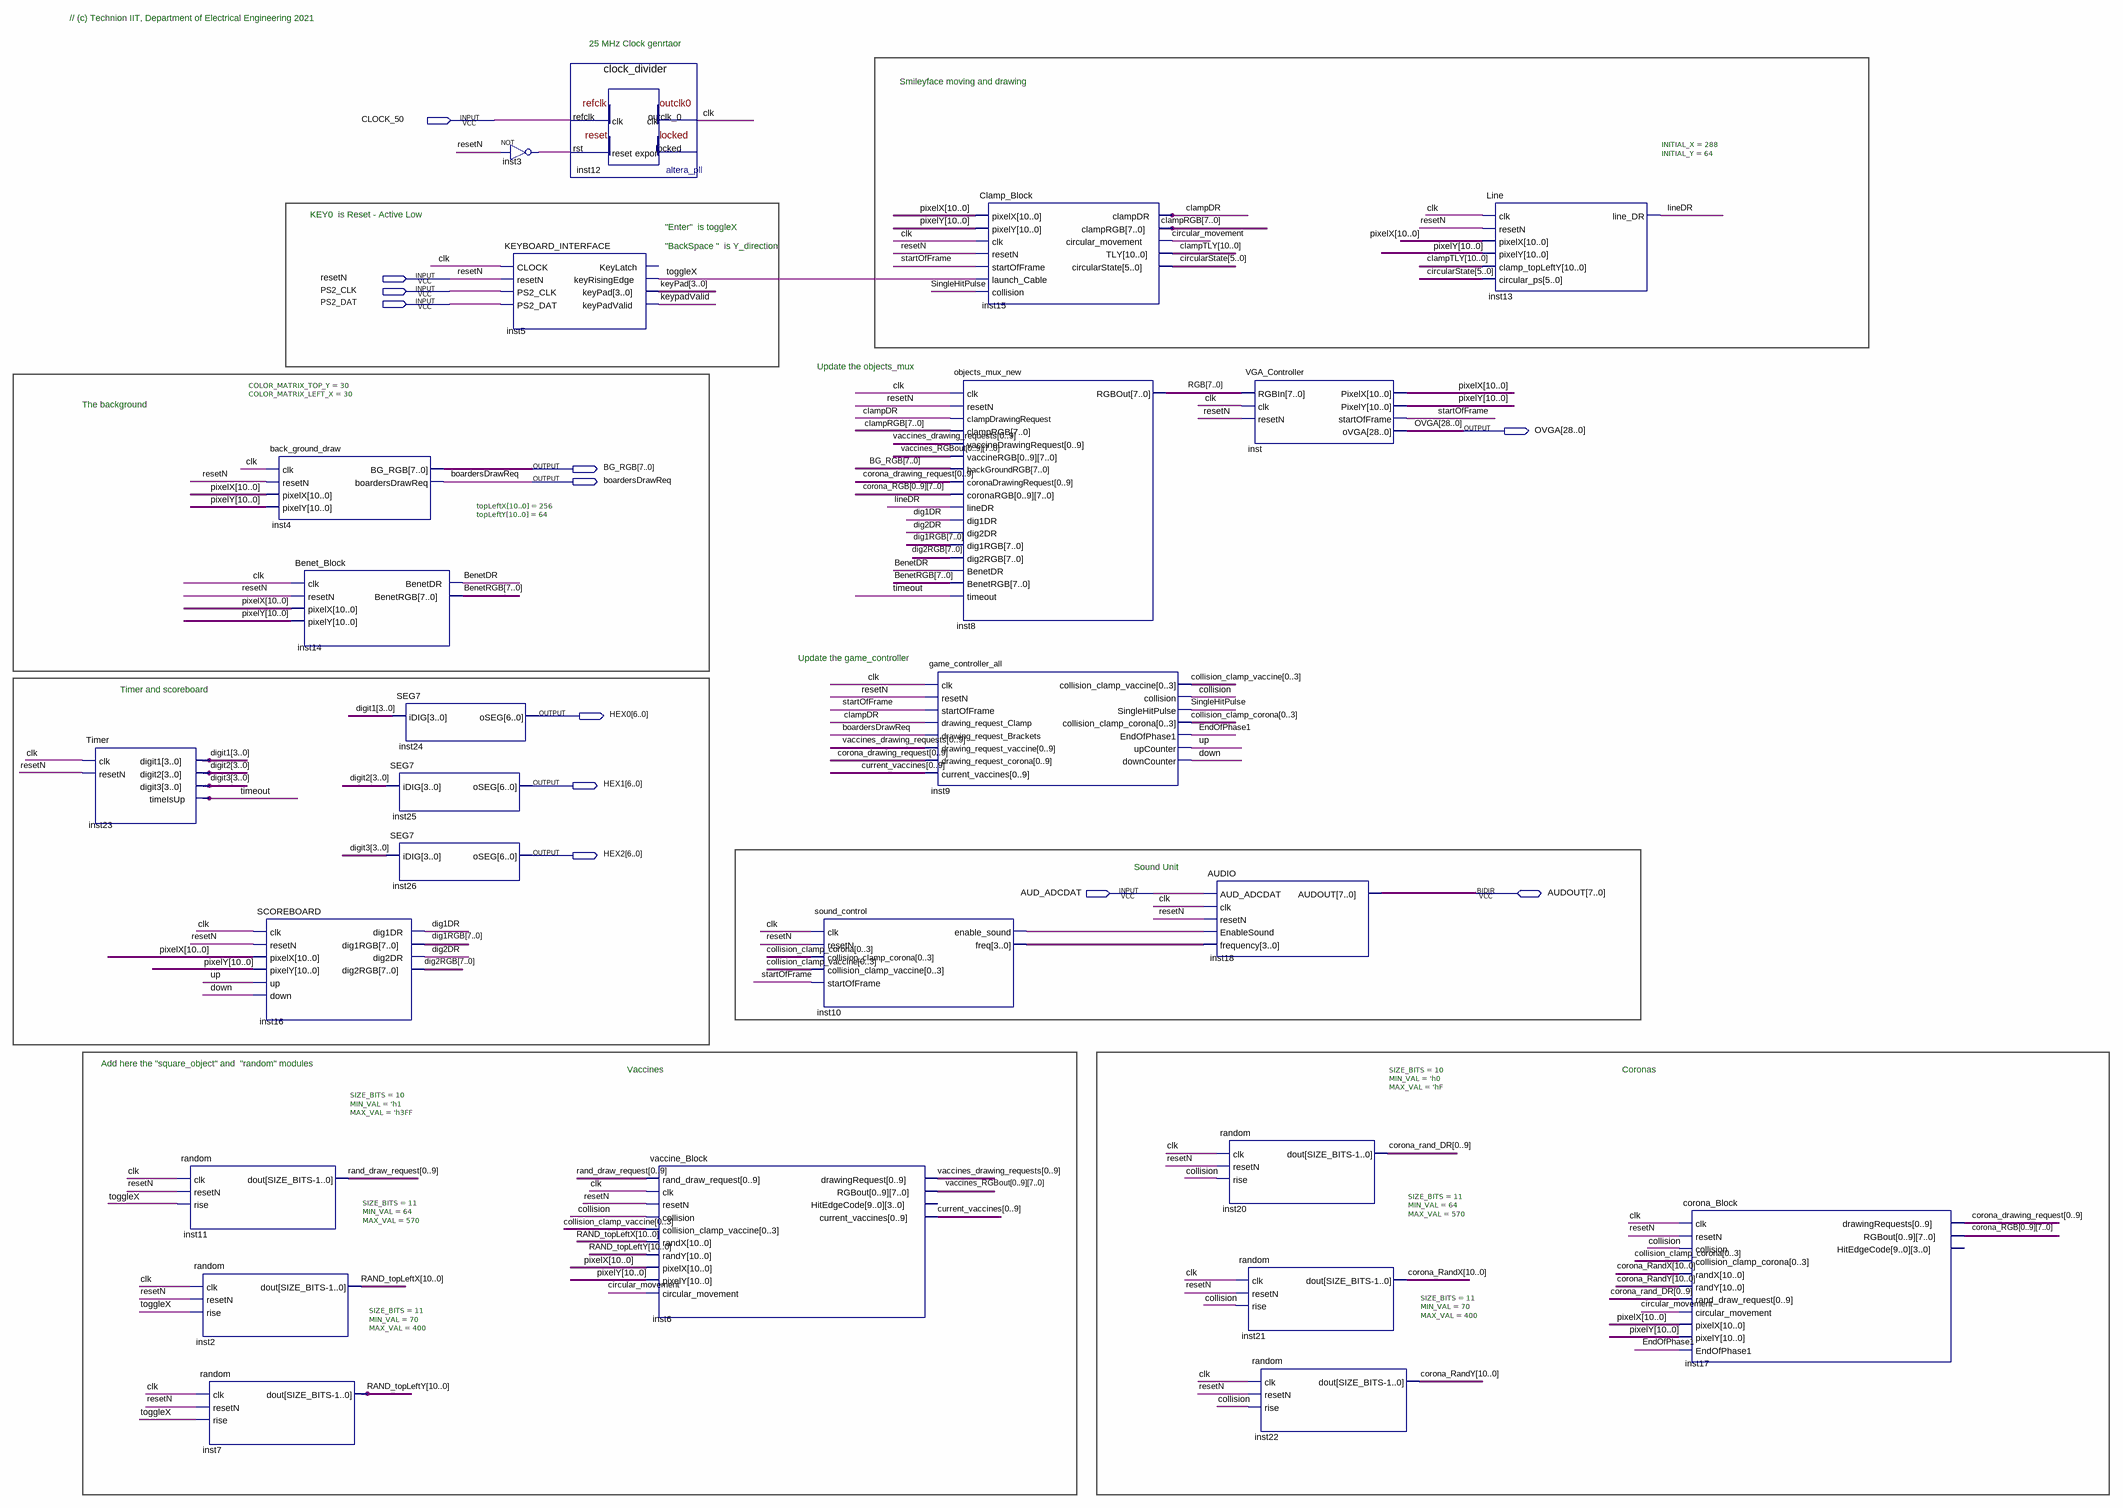
[diagram p0: schematic sheet]
// Quartus schematic TOP_VGA_DEMO_KBD.bdf as structural Verilog: 25 symbols, 12 pins
module TOP_VGA_DEMO_KBD (
  input  CLOCK_50,
  input  resetN,
  input  PS2_CLK,
  input  PS2_DAT,
  input  AUD_ADCDAT,
  inout  [7:0] AUDOUT,
  output [28:0] OVGA,
  output [7:0] BG_RGB,
  output boardersDrawReq,
  output [6:0] HEX0,
  output [6:0] HEX1,
  output [6:0] HEX2
);

  wire BenetDR, circular_movement, clampDR, clk, collision, dig1DR, dig2DR, down, EndOfPhase1, inst3_out,
       inst10_enable_sound, keypadValid, lineDR, SingleHitPulse, startOfFrame, timeout, toggleX, up;
  wire [3:0] collision_clamp_corona, collision_clamp_vaccine, digit1, digit2, digit3, inst10_freq, keyPad;
  wire [5:0] circularState;
  wire [7:0] BenetRGB, clampRGB, corona_RGB_0, corona_RGB_1, corona_RGB_2, corona_RGB_3, corona_RGB_4,
       corona_RGB_5, corona_RGB_6, corona_RGB_7, corona_RGB_8, corona_RGB_9, dig1RGB, dig2RGB, RGB,
       vaccines_RGBout_0, vaccines_RGBout_1, vaccines_RGBout_2, vaccines_RGBout_3, vaccines_RGBout_4,
       vaccines_RGBout_5, vaccines_RGBout_6, vaccines_RGBout_7, vaccines_RGBout_8, vaccines_RGBout_9;
  wire [9:0] corona_drawing_request, corona_rand_DR, current_vaccines, rand_draw_request,
       vaccines_drawing_requests;
  wire [10:0] clampTLY, corona_RandX, corona_RandY, pixelX, pixelY, RAND_topLeftX, RAND_topLeftY;

  Timer inst23 (.clk(clk), .resetN(resetN), .digit1(digit1), .digit2(digit2), .digit3(digit3), .timeIsUp(timeout));
  random #(.SIZE_BITS(10), .MIN_VAL('h1), .MAX_VAL('h3FF)) inst11 (
    .clk(clk), .resetN(resetN), .rise(toggleX),
    .dout({rand_draw_request[0], rand_draw_request[1], rand_draw_request[2], rand_draw_request[3], rand_draw_request[4], rand_draw_request[5], rand_draw_request[6], rand_draw_request[7], rand_draw_request[8], rand_draw_request[9]}));
  random #(.SIZE_BITS(11), .MIN_VAL(64), .MAX_VAL(570)) inst2 (
    .clk(clk), .resetN(resetN), .rise(toggleX), .dout(RAND_topLeftX));
  random #(.SIZE_BITS(11), .MIN_VAL(70), .MAX_VAL(400)) inst7 (
    .clk(clk), .resetN(resetN), .rise(toggleX), .dout(RAND_topLeftY));
  SCOREBOARD inst16 (
    .clk(clk), .resetN(resetN), .pixelX(pixelX), .pixelY(pixelY), .up(up), .down(down), .dig1DR(dig1DR),
    .dig1RGB(dig1RGB), .dig2DR(dig2DR), .dig2RGB(dig2RGB));
  back_ground_draw #(.COLOR_MATRIX_TOP_Y(30), .COLOR_MATRIX_LEFT_X(30)) inst4 (
    .clk(clk), .resetN(resetN), .pixelX(pixelX), .pixelY(pixelY), .BG_RGB(BG_RGB),
    .boardersDrawReq(boardersDrawReq));
  Benet_Block #(.\topLeftX[10..0] (256), .\topLeftY[10..0] (64)) inst14 (
    .clk(clk), .resetN(resetN), .pixelX(pixelX), .pixelY(pixelY), .BenetDR(BenetDR), .BenetRGB(BenetRGB));
  SEG7 inst24 (.iDIG(digit1), .oSEG(HEX0));
  SEG7 inst25 (.iDIG(digit2), .oSEG(HEX1));
  SEG7 inst26 (.iDIG(digit3), .oSEG(HEX2));
  not inst3 (inst3_out, resetN);
  KEYBOARD_INTERFACE inst5 (
    .CLOCK(clk), .resetN(resetN), .PS2_CLK(PS2_CLK), .PS2_DAT(PS2_DAT), .keyRisingEdge(toggleX),
    .keyPad(keyPad), .keyPadValid(keypadValid));  // open: KeyLatch
  clock_divider inst12 (.refclk(CLOCK_50), .rst(inst3_out), .outclk_0(clk));  // open: locked
  vaccine_Block inst6 (
    .rand_draw_request({rand_draw_request[0], rand_draw_request[1], rand_draw_request[2], rand_draw_request[3], rand_draw_request[4], rand_draw_request[5], rand_draw_request[6], rand_draw_request[7], rand_draw_request[8], rand_draw_request[9]}),
    .clk(clk), .resetN(resetN), .collision(collision),
    .collision_clamp_vaccine({collision_clamp_vaccine[0], collision_clamp_vaccine[1], collision_clamp_vaccine[2], collision_clamp_vaccine[3]}),
    .randX(RAND_topLeftX), .randY(RAND_topLeftY), .pixelX(pixelX), .pixelY(pixelY),
    .circular_movement(circular_movement),
    .drawingRequest({vaccines_drawing_requests[0], vaccines_drawing_requests[1], vaccines_drawing_requests[2], vaccines_drawing_requests[3], vaccines_drawing_requests[4], vaccines_drawing_requests[5], vaccines_drawing_requests[6], vaccines_drawing_requests[7], vaccines_drawing_requests[8], vaccines_drawing_requests[9]}),
    .RGBout({vaccines_RGBout_0, vaccines_RGBout_1, vaccines_RGBout_2, vaccines_RGBout_3, vaccines_RGBout_4, vaccines_RGBout_5, vaccines_RGBout_6, vaccines_RGBout_7, vaccines_RGBout_8, vaccines_RGBout_9}),
    .current_vaccines({current_vaccines[0], current_vaccines[1], current_vaccines[2], current_vaccines[3], current_vaccines[4], current_vaccines[5], current_vaccines[6], current_vaccines[7], current_vaccines[8], current_vaccines[9]}));  // open: HitEdgeCode
  sound_control inst10 (
    .clk(clk), .resetN(resetN),
    .collision_clamp_corona({collision_clamp_corona[0], collision_clamp_corona[1], collision_clamp_corona[2], collision_clamp_corona[3]}),
    .collision_clamp_vaccine({collision_clamp_vaccine[0], collision_clamp_vaccine[1], collision_clamp_vaccine[2], collision_clamp_vaccine[3]}),
    .startOfFrame(startOfFrame), .enable_sound(inst10_enable_sound), .freq(inst10_freq));
  objects_mux_new inst8 (
    .clk(clk), .resetN(resetN), .clampDrawingRequest(clampDR), .clampRGB(clampRGB),
    .vaccineDrawingRequest({vaccines_drawing_requests[0], vaccines_drawing_requests[1], vaccines_drawing_requests[2], vaccines_drawing_requests[3], vaccines_drawing_requests[4], vaccines_drawing_requests[5], vaccines_drawing_requests[6], vaccines_drawing_requests[7], vaccines_drawing_requests[8], vaccines_drawing_requests[9]}),
    .vaccineRGB({vaccines_RGBout_0, vaccines_RGBout_1, vaccines_RGBout_2, vaccines_RGBout_3, vaccines_RGBout_4, vaccines_RGBout_5, vaccines_RGBout_6, vaccines_RGBout_7, vaccines_RGBout_8, vaccines_RGBout_9}),
    .backGroundRGB(BG_RGB),
    .coronaDrawingRequest({corona_drawing_request[0], corona_drawing_request[1], corona_drawing_request[2], corona_drawing_request[3], corona_drawing_request[4], corona_drawing_request[5], corona_drawing_request[6], corona_drawing_request[7], corona_drawing_request[8], corona_drawing_request[9]}),
    .coronaRGB({corona_RGB_0, corona_RGB_1, corona_RGB_2, corona_RGB_3, corona_RGB_4, corona_RGB_5, corona_RGB_6, corona_RGB_7, corona_RGB_8, corona_RGB_9}),
    .lineDR(lineDR), .dig1DR(dig1DR), .dig2DR(dig2DR), .dig1RGB(dig1RGB), .dig2RGB(dig2RGB),
    .BenetDR(BenetDR), .BenetRGB(BenetRGB), .timeout(timeout), .RGBOut(RGB));
  game_controller_all inst9 (
    .clk(clk), .resetN(resetN), .startOfFrame(startOfFrame), .drawing_request_Clamp(clampDR),
    .drawing_request_Brackets(boardersDrawReq),
    .drawing_request_vaccine({vaccines_drawing_requests[0], vaccines_drawing_requests[1], vaccines_drawing_requests[2], vaccines_drawing_requests[3], vaccines_drawing_requests[4], vaccines_drawing_requests[5], vaccines_drawing_requests[6], vaccines_drawing_requests[7], vaccines_drawing_requests[8], vaccines_drawing_requests[9]}),
    .drawing_request_corona({corona_drawing_request[0], corona_drawing_request[1], corona_drawing_request[2], corona_drawing_request[3], corona_drawing_request[4], corona_drawing_request[5], corona_drawing_request[6], corona_drawing_request[7], corona_drawing_request[8], corona_drawing_request[9]}),
    .current_vaccines({current_vaccines[0], current_vaccines[1], current_vaccines[2], current_vaccines[3], current_vaccines[4], current_vaccines[5], current_vaccines[6], current_vaccines[7], current_vaccines[8], current_vaccines[9]}),
    .collision_clamp_vaccine({collision_clamp_vaccine[0], collision_clamp_vaccine[1], collision_clamp_vaccine[2], collision_clamp_vaccine[3]}),
    .collision(collision), .SingleHitPulse(SingleHitPulse),
    .collision_clamp_corona({collision_clamp_corona[0], collision_clamp_corona[1], collision_clamp_corona[2], collision_clamp_corona[3]}),
    .EndOfPhase1(EndOfPhase1), .upCounter(up), .downCounter(down));
  Clamp_Block inst15 (
    .pixelX(pixelX), .pixelY(pixelY), .clk(clk), .resetN(resetN), .startOfFrame(startOfFrame),
    .launch_Cable(toggleX), .collision(SingleHitPulse), .clampDR(clampDR), .clampRGB(clampRGB),
    .circular_movement(circular_movement), .TLY(clampTLY), .circularState(circularState));
  AUDIO inst18 (
    .AUD_ADCDAT(AUD_ADCDAT), .clk(clk), .resetN(resetN), .EnableSound(inst10_enable_sound),
    .frequency(inst10_freq), .AUDOUT(AUDOUT));
  random #(.SIZE_BITS(10), .MIN_VAL('h0), .MAX_VAL('hF)) inst20 (
    .clk(clk), .resetN(resetN), .rise(collision),
    .dout({corona_rand_DR[0], corona_rand_DR[1], corona_rand_DR[2], corona_rand_DR[3], corona_rand_DR[4], corona_rand_DR[5], corona_rand_DR[6], corona_rand_DR[7], corona_rand_DR[8], corona_rand_DR[9]}));
  VGA_Controller inst (
    .RGBIn(RGB), .clk(clk), .resetN(resetN), .PixelX(pixelX), .PixelY(pixelY), .startOfFrame(startOfFrame),
    .oVGA(OVGA));
  random #(.SIZE_BITS(11), .MIN_VAL(64), .MAX_VAL(570)) inst21 (
    .clk(clk), .resetN(resetN), .rise(collision), .dout(corona_RandX));
  random #(.SIZE_BITS(11), .MIN_VAL(70), .MAX_VAL(400)) inst22 (
    .clk(clk), .resetN(resetN), .rise(collision), .dout(corona_RandY));
  Line #(.INITIAL_X(288), .INITIAL_Y(64)) inst13 (
    .clk(clk), .resetN(resetN), .pixelX(pixelX), .pixelY(pixelY), .clamp_topLeftY(clampTLY),
    .circular_ps(circularState), .line_DR(lineDR));
  corona_Block inst17 (
    .clk(clk), .resetN(resetN), .collision(collision),
    .collision_clamp_corona({collision_clamp_corona[0], collision_clamp_corona[1], collision_clamp_corona[2], collision_clamp_corona[3]}),
    .randX(corona_RandX), .randY(corona_RandY),
    .rand_draw_request({corona_rand_DR[0], corona_rand_DR[1], corona_rand_DR[2], corona_rand_DR[3], corona_rand_DR[4], corona_rand_DR[5], corona_rand_DR[6], corona_rand_DR[7], corona_rand_DR[8], corona_rand_DR[9]}),
    .circular_movement(circular_movement), .pixelX(pixelX), .pixelY(pixelY), .EndOfPhase1(EndOfPhase1),
    .drawingRequests({corona_drawing_request[0], corona_drawing_request[1], corona_drawing_request[2], corona_drawing_request[3], corona_drawing_request[4], corona_drawing_request[5], corona_drawing_request[6], corona_drawing_request[7], corona_drawing_request[8], corona_drawing_request[9]}),
    .RGBout({corona_RGB_0, corona_RGB_1, corona_RGB_2, corona_RGB_3, corona_RGB_4, corona_RGB_5, corona_RGB_6, corona_RGB_7, corona_RGB_8, corona_RGB_9}));  // open: HitEdgeCode

  // Notes on the sheet:
  //   // (c) Technion IIT, Department of Electrical Engineering 2021
  //   25 MHz Clock genrtaor
  //   Smileyface moving and drawing
  //   KEY0  is Reset - Active Low
  //   "Enter"  is toggleX
  //   "BackSpace "  is Y_direction
  //   Update the objects_mux
  //   The background
  //   Update the game_controller
  //   Timer and scoreboard
  //   Sound Unit
  //   Add here the "square_object" and  "random" modules
  //   Vaccines
  //   Coronas
endmodule
